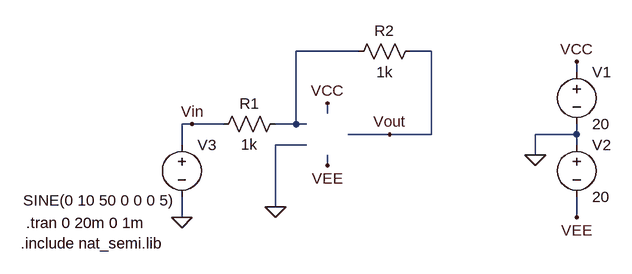
[diagram p0: schematic Inverterting.asc]
Inverterting.asc, the LTspice schematic file:
Version 4
SHEET 1 880 680
WIRE 176 32 80 32
WIRE 288 32 256 32
WIRE 512 64 512 48
WIRE 128 128 128 112
WIRE -80 144 -96 144
WIRE -32 144 -80 144
WIRE 80 144 80 32
WIRE 80 144 48 144
WIRE 96 144 80 144
WIRE 224 160 160 160
WIRE 288 160 288 32
WIRE 288 160 224 160
WIRE 512 160 512 144
WIRE 512 160 448 160
WIRE -96 176 -96 144
WIRE 96 176 48 176
WIRE 512 176 512 160
WIRE 448 192 448 160
WIRE 128 208 128 192
WIRE 48 272 48 176
WIRE -96 288 -96 256
WIRE 512 288 512 256
FLAG 512 48 VCC
FLAG 512 288 VEE
FLAG 448 192 0
FLAG 128 112 VCC
FLAG 128 208 VEE
FLAG 48 272 0
FLAG -96 288 0
FLAG 224 160 Vout
FLAG -80 144 Vin
SYMBOL res 64 128 R90
WINDOW 0 0 56 VBottom 2
WINDOW 3 32 56 VTop 2
SYMATTR InstName R1
SYMATTR Value 1k
SYMBOL res 272 16 R90
WINDOW 0 0 56 VBottom 2
WINDOW 3 32 56 VTop 2
SYMATTR InstName R2
SYMATTR Value 1k
SYMBOL voltage 512 48 R0
SYMATTR InstName V1
SYMATTR Value 20
SYMBOL voltage 512 160 R0
SYMATTR InstName V2
SYMATTR Value 20
SYMBOL voltage -96 160 R0
WINDOW 3 -244 102 Left 2
WINDOW 123 0 0 Left 2
WINDOW 39 0 0 Left 2
SYMATTR Value SINE(0 10 50 0 0 0 5)
SYMATTR InstName V3
TEXT -344 328 Left 2 !.include nat_semi.lib
TEXT -336 296 Left 2 !.tran 0 20m 0 1m

The netlist it stands for:
* Inverterting.asc
R1 N001 Vin 1k
R2 Vout N001 1k
V1 VCC 0 20
V2 0 VEE 20
V3 Vin 0 SINE(0 10 50 0 0 0 5)
.include nat_semi.lib
.tran 0 20m 0 1m
.backanno
.end

* Results of the author's LTspice run, read from the files saved beside the schematic
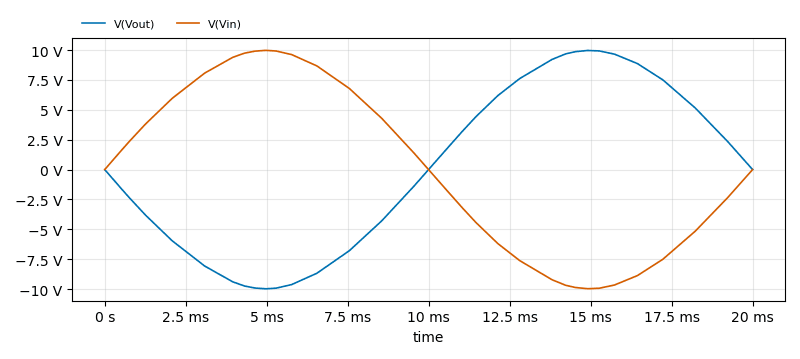
[diagram p1: Transient Analysis of Inverterting.asc, plotted from the saved traces]
* Transient Analysis, 1 run:
*   V(Vout): min -9.972 V, max 9.965 V, average 15.77 mV, rms 6.999 V, last 3.19 mV
*   V(Vin): min -9.963 V, max 9.974 V, average -13.67 mV, rms 6.999 V, last 0 V